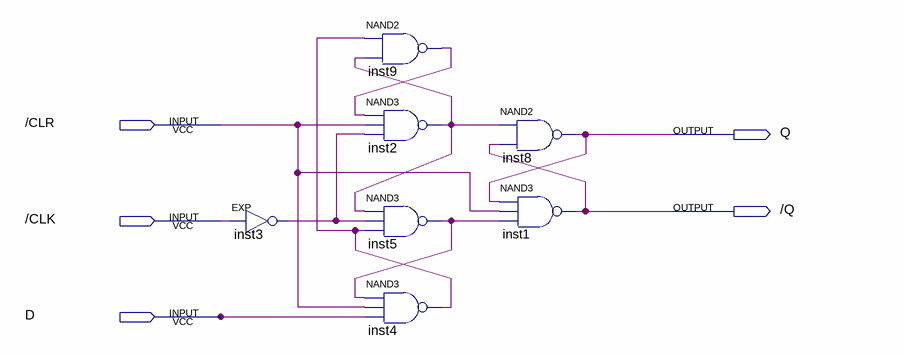
[diagram p0: schematic sheet]
// Quartus schematic FlipFlopD.bdf as structural Verilog: 7 symbols, 5 pins
module FlipFlopD (
  input  \/CLR ,
  input  \/CLK ,
  input  D,
  output Q,
  output \/Q 
);

  wire inst2_out, inst3_out, inst4_out, inst5_out, inst9_out;

  EXP inst3 (.IN(\/CLK ), .OUT(inst3_out));
  nand inst9 (inst9_out, inst4_out, inst2_out);
  nand inst2 (inst2_out, inst9_out, \/CLR , inst3_out);
  nand inst5 (inst5_out, inst2_out, inst3_out, inst4_out);
  nand inst4 (inst4_out, inst5_out, \/CLR , D);
  nand inst8 (Q, inst2_out, \/Q );
  nand inst1 (\/Q , Q, \/CLR , inst5_out);
endmodule
